# EAGLE schematic Audi Amp (EAGLE 9.2.0)
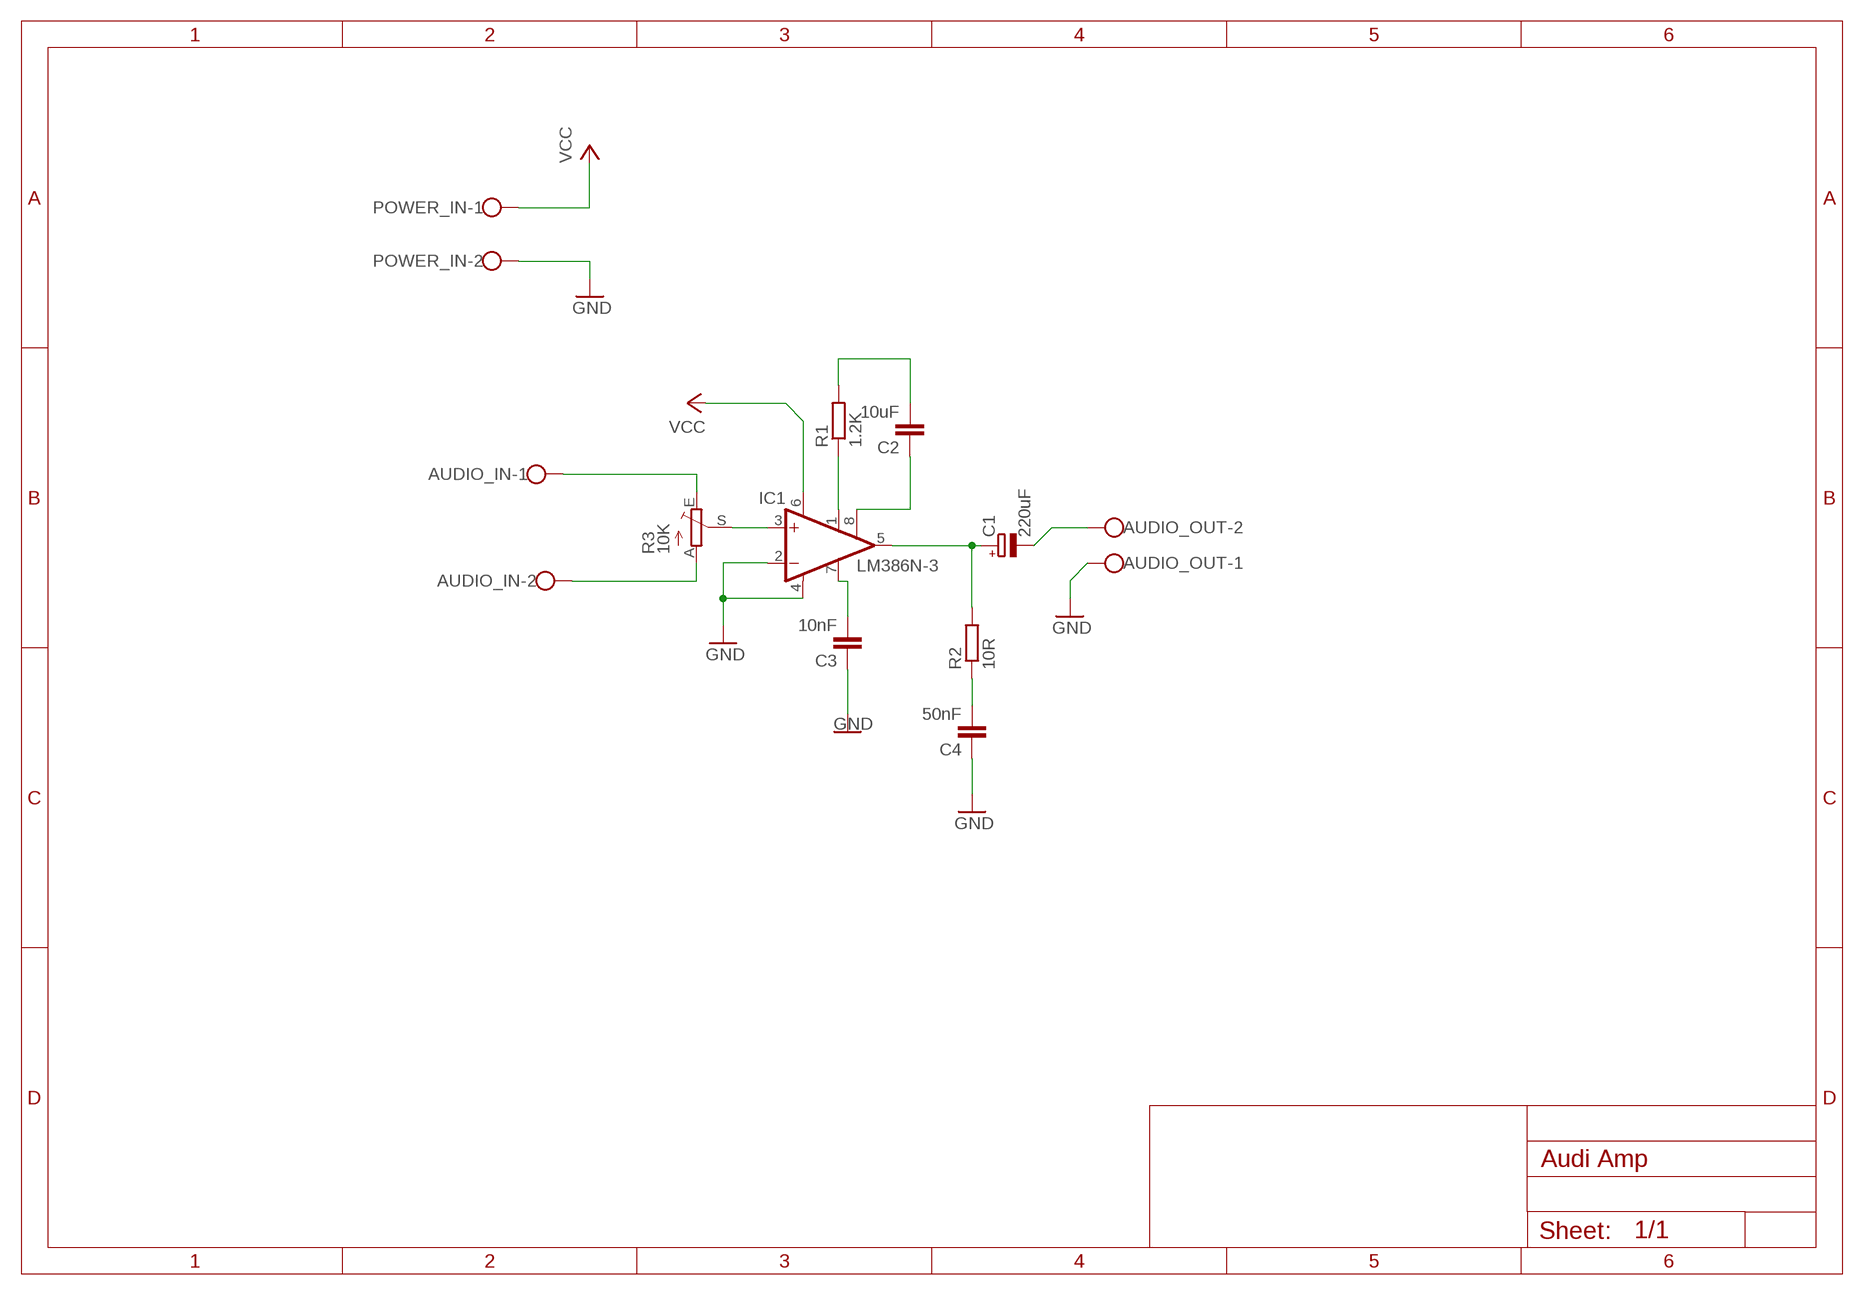
[diagram p0: schematic, sheet 1]

## Parts
AUDIO_IN  W237-102  [W237-102]
AUDIO_OUT  W237-102  [W237-102]
C1  220uF  CPOL-EUE3.5-8  [E3,5-8]
C2  10uF  C-EU075-032X103  [C075-032X103]
C3  10nF  C-EU075-032X103  [C075-032X103]
C4  50nF  C-EU075-032X103  [C075-032X103]
IC1  LM386N-3  [DIL08]
POWER_IN  W237-102  [W237-102]
R1  1.2K  R-EU_0204/7  [0204/7]
R2  10R  R-EU_0204/7  [0204/7]
R3  10K  TRIM_EU-B64Y  [B64Y]

## Nets
GND: AUDIO_OUT.1 C3.1 C4.1 IC1.2(-IN) IC1.4(GND) POWER_IN.2
N$1: AUDIO_IN.1 R3.E
N$2: AUDIO_IN.2 R3.A
N$3: IC1.3(+IN) R3.S
N$4: IC1.1(GAIN) R1.1
N$5: C2.2 R1.2
N$6: C2.1 IC1.8(GAIN)
N$7: C3.2 IC1.7(BYPASS)
N$8: C4.2 R2.1
N$9: C1.+ IC1.5(OUT) R2.2
N$10: AUDIO_OUT.2 C1.-
VCC: IC1.6(VS) POWER_IN.1

## Library data of the parts
AUDIO_IN AUDIO_OUT POWER_IN = con-wago-500:W237-102: WAGO SCREW CLAMP; MPN: 237-102; OC_FARNELL: unknown; OC_NEWARK: 70K9898
C1 = rcl:CPOL-EU: POLARIZED CAPACITOR, European symbol; SPICEPREFIX: C
C2-C4 = rcl:C-EU: CAPACITOR, European symbol; SPICEPREFIX: C
IC1 = linear:LM386?-*: Low Voltage Audio Power Amplifier Source: http://cache.national.com/ds/LM/LM386.pdf
R1 R2 = rcl:R-EU_: RESISTOR, European symbol; SPICEPREFIX: R
R3 = pot:TRIM_EU-: POTENTIOMETER